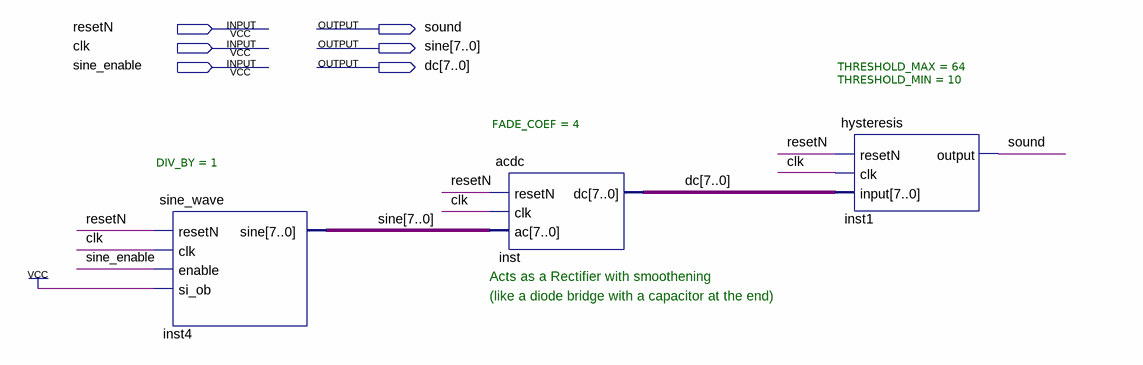
[diagram p0: schematic sheet]
// Quartus schematic sine_wave_detection_example.bdf as structural Verilog: 3 symbols, 6 pins
module sine_wave_detection_example (
  input  resetN,
  input  clk,
  input  sine_enable,
  output sound,
  output [7:0] sine,
  output [7:0] dc
);

  sine_wave #(.DIV_BY(1)) inst4 (.resetN(resetN), .clk(clk), .enable(sine_enable), .si_ob(1'b1), .sine(sine));
  acdc #(.FADE_COEF(4)) inst (.resetN(resetN), .clk(clk), .ac(sine), .dc(dc));
  hysteresis #(.THRESHOLD_MAX(64), .THRESHOLD_MIN(10)) inst1 (
    .resetN(resetN), .clk(clk), .\input (dc), .\output (sound));

  // Notes on the sheet:
  //   Acts as a Rectifier with smoothening
  //   (like a diode bridge with a capacitor at the end)
endmodule
